# EAGLE design linkitsmart7688duo_doorcontroller (EAGLE 7.7.0)
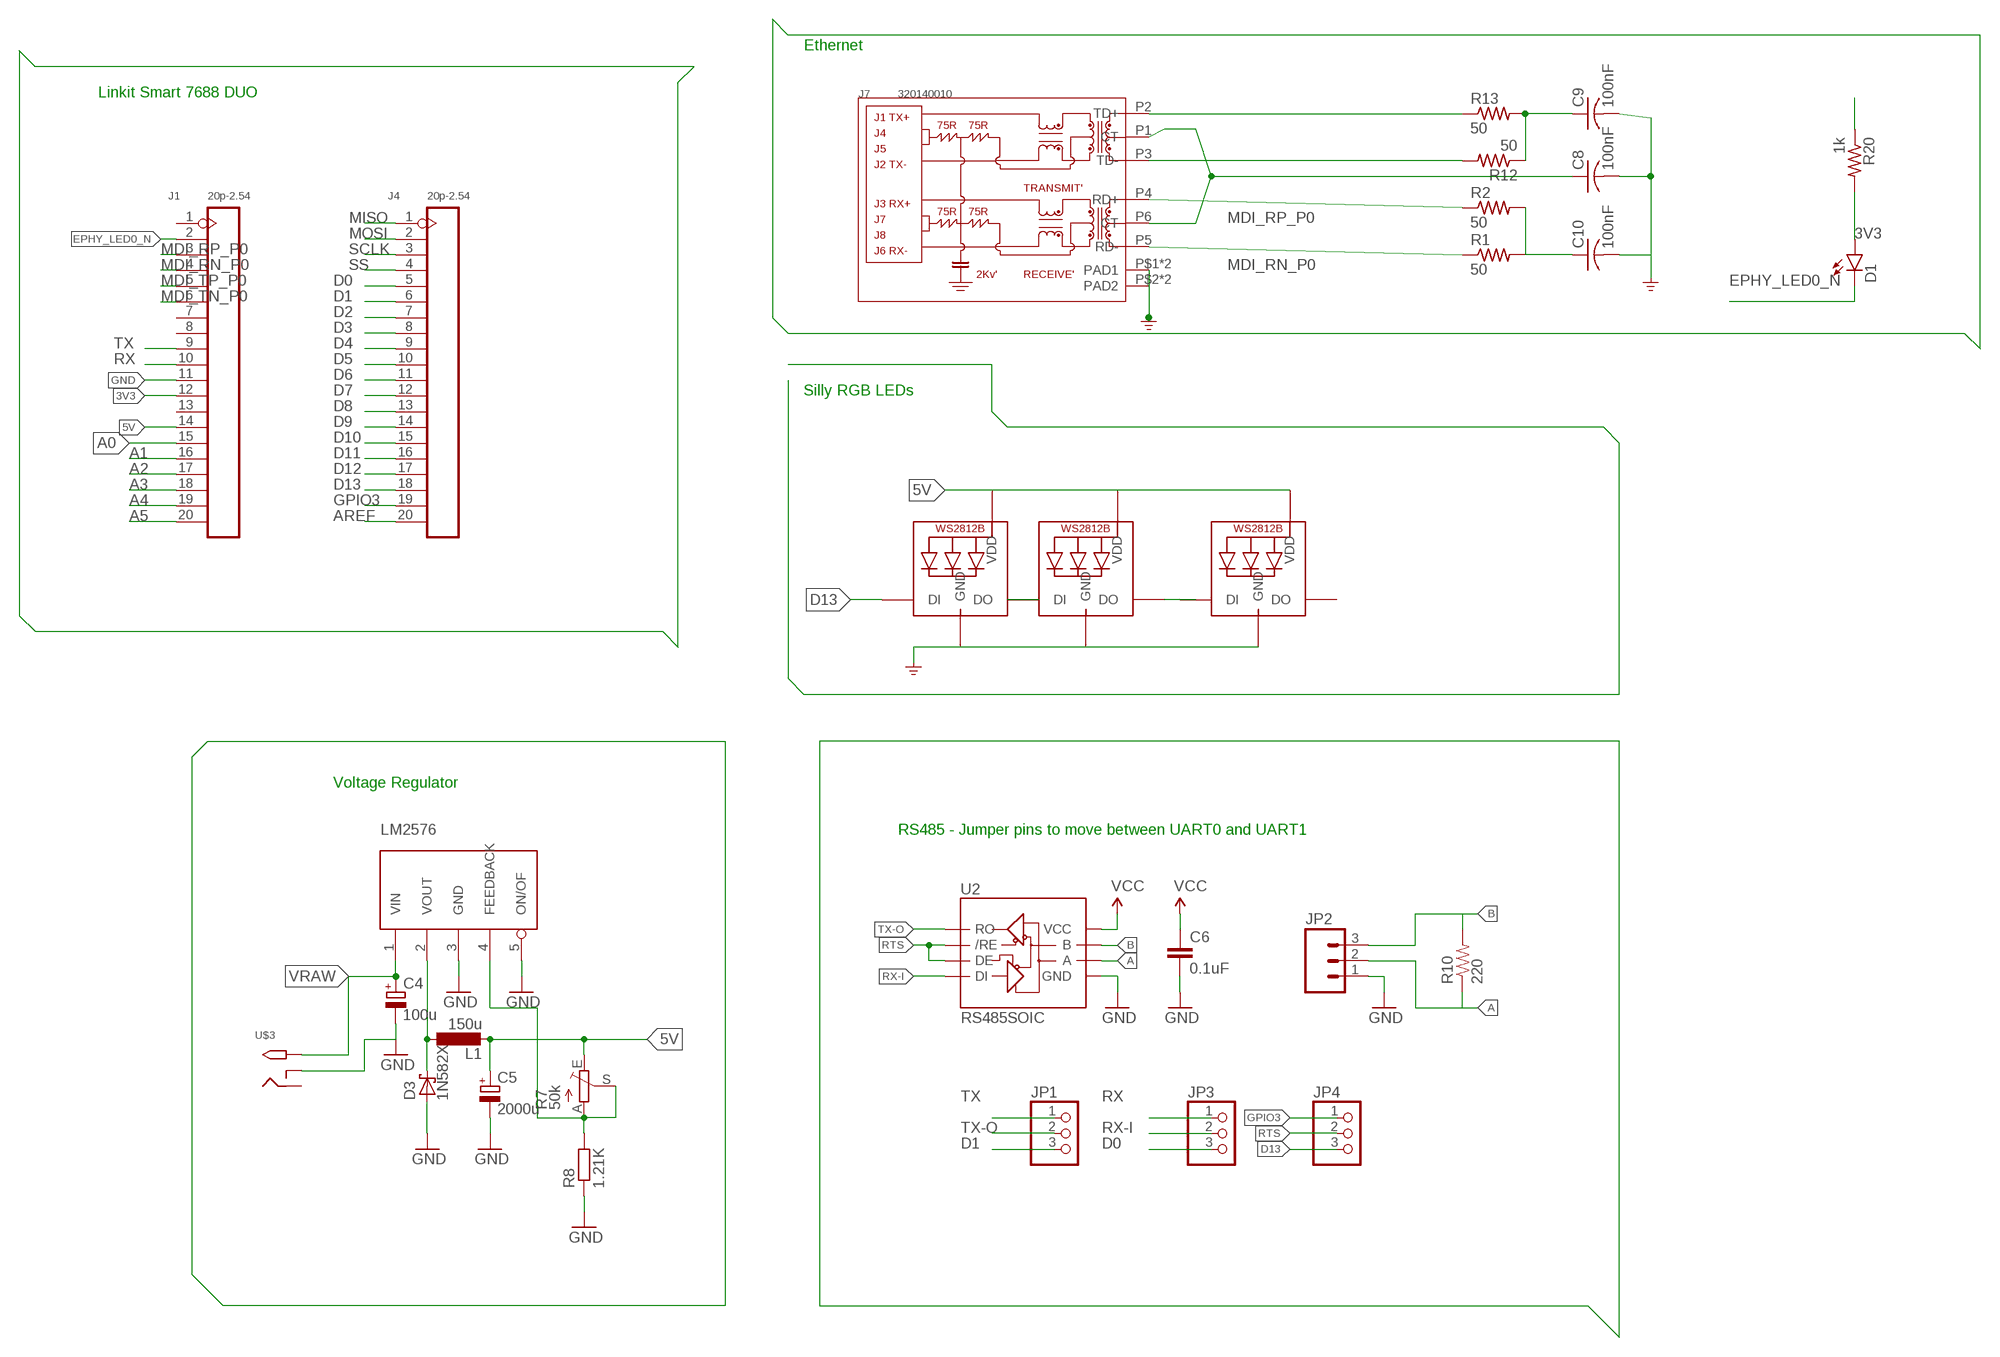
[diagram p0: schematic, sheet 1, part 1 of 2]
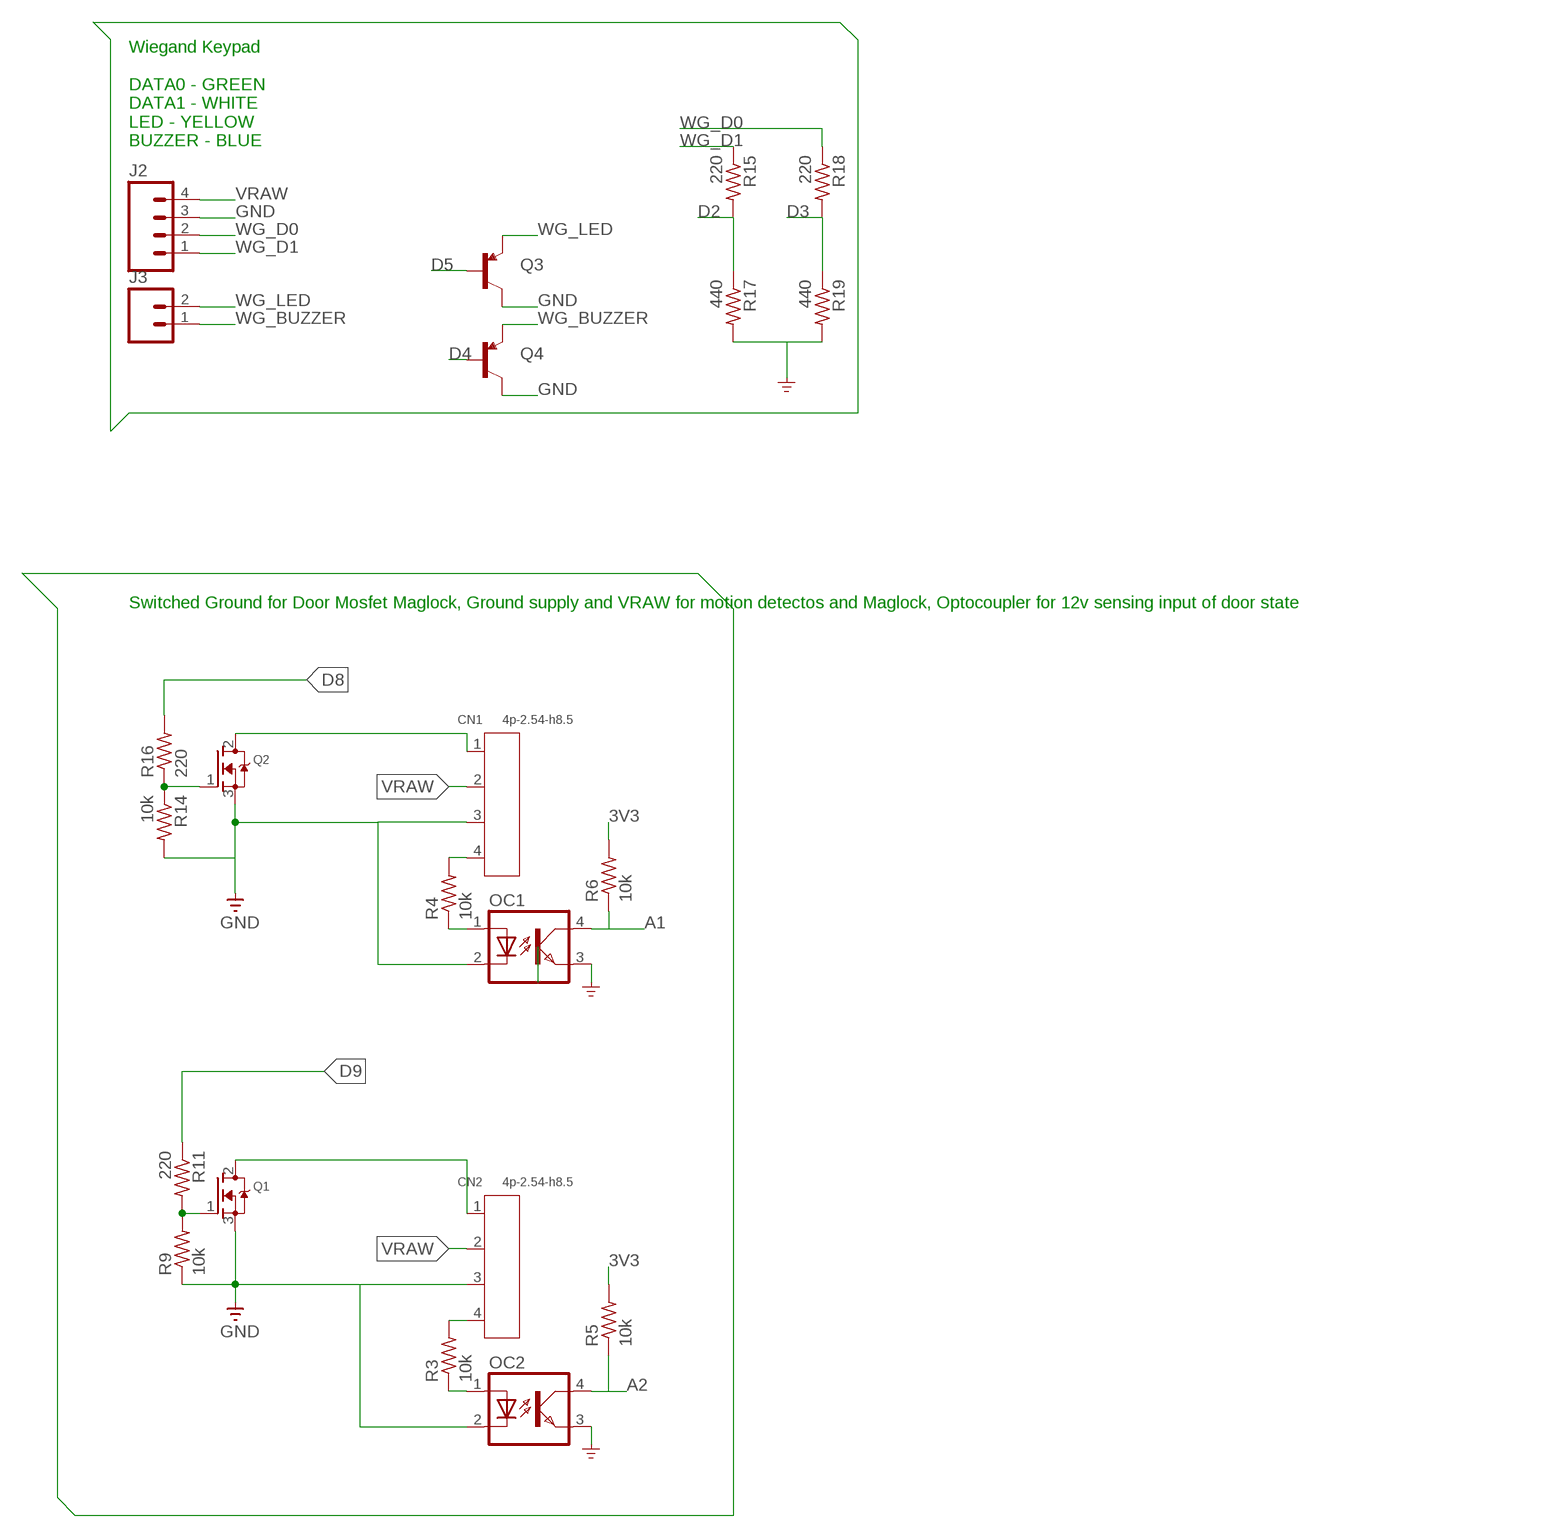
[diagram p1: schematic, sheet 1, part 2 of 2]

## Parts
C4  100u  CPOL-EUE3.5-10  [E3,5-10]
C5  2000u  CPOL-EUE7.5-18  [E7,5-18]
C6  0.1uF  0.1UF-25V(+80/-20%)(0603)  [0603-CAP]
C8  100nF  C-US025-024X044  [C025-024X044]
C9  100nF  C-US025-024X044  [C025-024X044]
C10  100nF  C-US025-024X044  [C025-024X044]
CN1  4p-2.54-h8.5  DIP-SCREW-TERMINAL-GREEN(4P-2.54-H8.5)  [H4-2.54-8.52X6.3MM]
CN2  4p-2.54-h8.5  DIP-SCREW-TERMINAL-GREEN(4P-2.54-H8.5)  [H4-2.54-8.52X6.3MM]
D1  LED3MM  [LED3MM]
D3  1N582X  [DO201T15]
J1  20p-2.54  DIP-BLACK-FEMALE-HEADER-VERT(20P-2.54)  [H20-2.54]
J2  M04SCREW  [SCREWTERMINAL-3.5MM-4]
J3  M023.5MM  [SCREWTERMINAL-3.5MM-2]
J4  20p-2.54  DIP-BLACK-FEMALE-HEADER-VERT(20P-2.54)  [H20-2.54]
J7  320140010  RJ45-MJ6-BX11-RVS1T073  [RJ45-MJ6-BX11-RVS1T073]
JP1  PINHD-1X3  [1X03]
JP2  M03SCREW  [SCREWTERMINAL-3.5MM-3]
JP3  PINHD-1X3  [1X03]
JP4  PINHD-1X3  [1X03]
L1  150u  MY-INDUCTANCE  [MY-INDUCTANCE]
LED4  WS2812B_5050N  [WS2812B-NARROW]
LED5  WS2812B_5050N  [WS2812B-NARROW]
LED6  WS2812B_5050N  [WS2812B-NARROW]
OC1  PC817  [DIL04]
OC2  PC817  [DIL04]
Q1  MOSFET-NGDS_TO220V  [TO220V]
Q2  MOSFET-NGDS_TO220V  [TO220V]
Q3  TRANSISTOR_PNPBC558  [TO-92-AMMO]
Q4  TRANSISTOR_PNPBC558  [TO-92-AMMO]
R1  50  FLIPFLOP-RES  [0805-THM]
R2  50  FLIPFLOP-RES  [0805-THM]
R3  10k  FLIPFLOP-RES  [0805-THM]
R4  10k  FLIPFLOP-RES  [0805-THM]
R5  10k  FLIPFLOP-RES  [0805-THM]
R6  10k  FLIPFLOP-RES  [0805-THM]
R7  50k  TRIM_EU-RJ9W  [RJ9W]
R8  1.21K  R-EU_0204/7  [0204/7]
R9  10k  FLIPFLOP-RES  [0805-THM]
R10  220  22OHM1/10W1%(0603)  [0603-RES]
R11  220  FLIPFLOP-RES  [0805-THM]
R12  50  FLIPFLOP-RES  [0805-THM]
R13  50  FLIPFLOP-RES  [0805-THM]
R14  10k  FLIPFLOP-RES  [0805-THM]
R15  220  FLIPFLOP-RES  [0805-THM]
R16  220  FLIPFLOP-RES  [0805-THM]
R17  440  FLIPFLOP-RES  [0805-THM]
R18  220  FLIPFLOP-RES  [0805-THM]
R19  440  FLIPFLOP-RES  [0805-THM]
R20  1k  FLIPFLOP-RES  [0805-THM]
U2  RS485SOIC  [SO08]
U$1  LM2576  [TO220-5]
U$3  2.1MMJACKTHM  [PJ-102A]

## Nets
3V3: J1.12 R5.2 R6.2 R20.1
5V [power]: C5.+ C6.1 J1.14 L1.P$2 LED4.1-VDD(VDD) LED5.1-VDD(VDD) LED6.1-VDD(VDD) R7.E U2.8(VCC) ; supply symbol labelled VCC
A: JP2.2 R10.1 U2.6(A)
A0: J1.15
A1: J1.16 OC1.4(COL) R6.1
A2: J1.17 OC2.4(COL) R5.1
A3: J1.18
A4: J1.19
A5: J1.20
AREF: J4.20
B: JP2.3 R10.2 U2.7(B)
D0: J4.5 JP3.3
D1: J4.6 JP1.3
D2: J4.7 R15.2 R17.1
D3: J4.8 R18.2 R19.1
D4: J4.9 Q4.2(B)
D5: J4.10 Q3.2(B)
D6: J4.11
D7: J4.12
D8: J4.13 R16.2
D9: J4.14 R11.1
D10: J4.15
D11: J4.16
D12: J4.17
D13: J4.18 JP4.3 LED4.4-DIN(DI)
EPHY_LED0_N: D1.K(C) J1.2
GND [power]: C4.- C5.- C6.2 C8.2 C9.2 C10.2 CN1.3 CN2.3 D3.A J1.11 J2.3 J7.P$1(PAD1) J7.P$2(PAD2) J7.PAD1 J7.PAD2 JP2.1 LED4.3-GND(GND) LED5.3-GND(GND) LED6.3-GND(GND) OC1.2(C) OC1.3(EMIT) OC2.2(C) OC2.3(EMIT) Q1.3(S) Q2.3(S) Q3.1(C) Q4.1(C) R8.1 R9.1 R14.2 R17.2 R19.2 U2.5(GND) U$1.3(GND) U$1.5(ON/OF) U$3.RING_SW ; supply symbol labelled GND_POWER
GPIO3: J4.19 JP4.1
MDI_RN_P0: J1.4 J7.P5(RD-) R1.1
MDI_RP_P0: J1.3 J7.P4(RD+) R2.1
MDI_TN_P0: J1.6 J7.P3(TD-) R12.2
MDI_TP_P0: J1.5 J7.P2(TD+) R13.1
MISO: J4.1
MOSI: J4.2
N$1: R7.A R7.S R8.2 U$1.4(FEEDBACK)
N$3: D3.C L1.P$1 U$1.2(VOUT)
N$4: Q1.1(G) R9.2 R11.2
N$5: CN2.1 Q1.2(D)
N$6: C8.1 J7.P1(CT) J7.P6(CT)
N$7: CN1.1 Q2.2(D)
N$8: Q2.1(G) R14.1 R16.1
N$9: C9.1 R12.1 R13.2
N$11: CN1.4 R4.2
N$12: C10.1 R1.2 R2.2
N$13: OC2.1(A) R3.1
N$14: D1.A R20.2
N$15: LED4.2-DOUT(DO) LED5.4-DIN(DI)
N$16: LED5.2-DOUT(DO) LED6.4-DIN(DI)
N$17: CN2.4 R3.2
N$18: OC1.1(A) R4.1
RTS: JP4.2 U2.2(/RE) U2.3(DE)
RX: J1.10 JP3.1
RX-I: JP3.2 U2.4(DI)
SCLK: J4.3
SS: J4.4
TX: J1.9 JP1.1
TX-O: JP1.2 U2.1(RO)
VRAW [power]: C4.+ CN1.2 CN2.2 J2.4 U$1.1(VIN) U$3.TIP
WG_BUZZER: J3.1 Q4.3(E)
WG_D0: J2.2 R18.1
WG_D1: J2.1 R15.1
WG_LED: J3.2 Q3.3(E)
Unconnected: J1.1 J1.7 J1.8 J1.13 LED6.2-DOUT(DO) U$3.RING

## Notes on the sheet
- Ethernet
- Linkit Smart 7688 DUO
- Wiegand Keypad
  
  DATA0 - GREEN
  DATA1 - WHITE
  LED - YELLOW
  BUZZER - BLUE
- Silly RGB LEDs
- Switched Ground for Door Mosfet Maglock, Ground supply and VRAW for motion detectos and Maglock, Optocoupler for 12v sensing input of door state
- Voltage Regulator
- RS485 - Jumper pins to move between UART0 and UART1

## Library data of the parts
C4 = rcl:CPOL-EU: POLARIZED CAPACITOR, European symbol; MPN: UPW1E101MED; OC_NEWARK: 55K0210
C5 = rcl:CPOL-EU: POLARIZED CAPACITOR, European symbol; MPN: ERJ-14NF2000U; OC_NEWARK: 53W4097
C6 = SparkFun-Capacitors:0.1UF-25V(+80/-20%)(0603): CAP-00810 Ceramic Standard decoupling cap; MF: CORNELL DUBILIER; MPN: 104M06QC100; OC_NEWARK: 72K6759; PROD_ID: CAP-00810
C8-C10 = adafruit:C-US: CAPACITOR, American symbol
CN1 CN2 = Seeed-OPL-Connector:DIP-SCREW-TERMINAL-GREEN(4P-2.54-H8.5): 320110118; MPN: GS019-2.54-4P-1
D1 = SparkFun-LED:LED: LEDs Standard schematic elements and footprints for 5mm, 3mm, 1206, and 0603 sized LEDs. 5mm - Spark Fun Electronics SKU : COM-00529 (and others); PROD_ID: DIO-08794
D3 = mylib:1N582X; OC_NEWARK: unknown
J1 J4 = Seeed-OPL-Connector:DIP-BLACK-FEMALE-HEADER-VERT(20P-2.54): 320030027; MPN: F185-1120A0BSYA1
J2 = SparkFun-Connectors:M04: Header 4 Standard 4-pin 0.1" header. Use with straight break away headers (SKU : PRT-00116), right angle break away headers (PRT-00553), swiss pins (PRT-00743), machine pins (PRT-00117), and female headers (PRT-00115). Molex polarized connector foot print use with SKU : PRT-08231 with associated crimp pins and housings. 1MM SMD Version SKU: PRT-10208; PROD_ID: Combine 2x8399
J3 = SparkFun-Connectors:M02: Standard 2-pin 0.1" header. Use with - straight break away headers ( PRT-00116) - right angle break away headers (PRT-00553) - swiss pins (PRT-00743) - machine pins (PRT-00117) - female headers (PRT-00115) Molex polarized connector foot print use with: PRT-08233 with associated crimp pins and housings. 2.54_SCREWTERM for use with PRT-10571. 3.5mm Screw Terminal footprints for PRT-08084 5mm Screw Terminal footprints for use with PRT-08432; PROD_ID: CONN-08399
J7 = Connector-new:RJ45-MJ6-BX11-RVS1T073: 320140010; OC_NEWARK: unknown
JP1 JP3 JP4 = adafruit:PINHD-1X3: PIN HEADER
JP2 = SparkFun:M03: Header 3 Standard 3-pin 0.1" header. Use with straight break away headers (SKU : PRT-00116), right angle break away headers (PRT-00553), swiss pins (PRT-00743), machine pins (PRT-00117), and female headers (PRT-00115). Molex polarized connector foot print use with SKU : PRT-08232 with associated crimp pins and housings.; OC_NEWARK: unknown
L1 = mylib:MY-INDUCTANCE; MPN: ACS770KCB-150U-PFF-T; OC_NEWARK: 12X7864
LED4-LED6 = adafruit:WS2812B
OC1 OC2 = optocoupler:PC817: SHARP OPTO COUPLER
Q1 Q2 = adafruit:MOSFET-N: N-Channel Mosfet 2N7002E - 60V 260mA SOT23 [Digikey: 2N7002ET1GOSTR-ND] - REEL BSH103 - 30V 850mA SOT23 [Digikey: 568-5013-1-ND]; MPN: SM6T68A; OC_NEWARK: 34M8616
Q3 Q4 = User-Submitted:TRANSISTOR_PNP: Generic PNP BJT Double check pinouts against datasheets- not all devices are the same! MMBT3906 - 40V 200mA SOT-23 (TRANS-08052) MMBT4403 - 40V 600mA SOT-23 (TRANS-09245)
R1-R6 R9 R11-R20 = adafruit:FLIPFLOP-RES: Flip Flop resistor An 0805 resistor inside a standard 1/4W 5% resistor. Makes for easy mods
R7 = pot:TRIM_EU-: POTENTIOMETER; MPN: MC00625W04021150K; OC_NEWARK: 94W5316
R8 = resistor:R-EU_: RESISTOR, European symbol; MPN: ERJ-8ENF1211V; OC_NEWARK: 65T8849
R10 = SparkFun-Resistors:22OHM1/10W1%(0603): RES-08698; MF: KEMET; MPN: C0603C221K5RACTU; OC_NEWARK: 64K2849; PROD_ID: RES-08698; VALUE: 22
U2 = SparkFun:RS485; MF: ALTERA CORPORATION; MPN: ADM4850ARZ; OC_NEWARK: 59K2126
U$1 = mylib:LM2576; MF: NATIONAL SEMICONDUCTOR; MPN: LM2576T-12/NOPB; OC_NEWARK: 41K3697
U$3 = adafruit:2.1MMJACK: 2.1mm x 5.5mm THM DC jack with internal switch. Digikey part #PJ-102A, 4UCON part #05537 2.1mm x 5.5mm SMT DC jack with internal switch. Digikey part #PJ-002A-SMT, 4UCON part #03267 By microbuilder.eu & adafruit.com

## Net classes
0 default: width 0.254 mm
1 power: width 0.762 mm

## Board
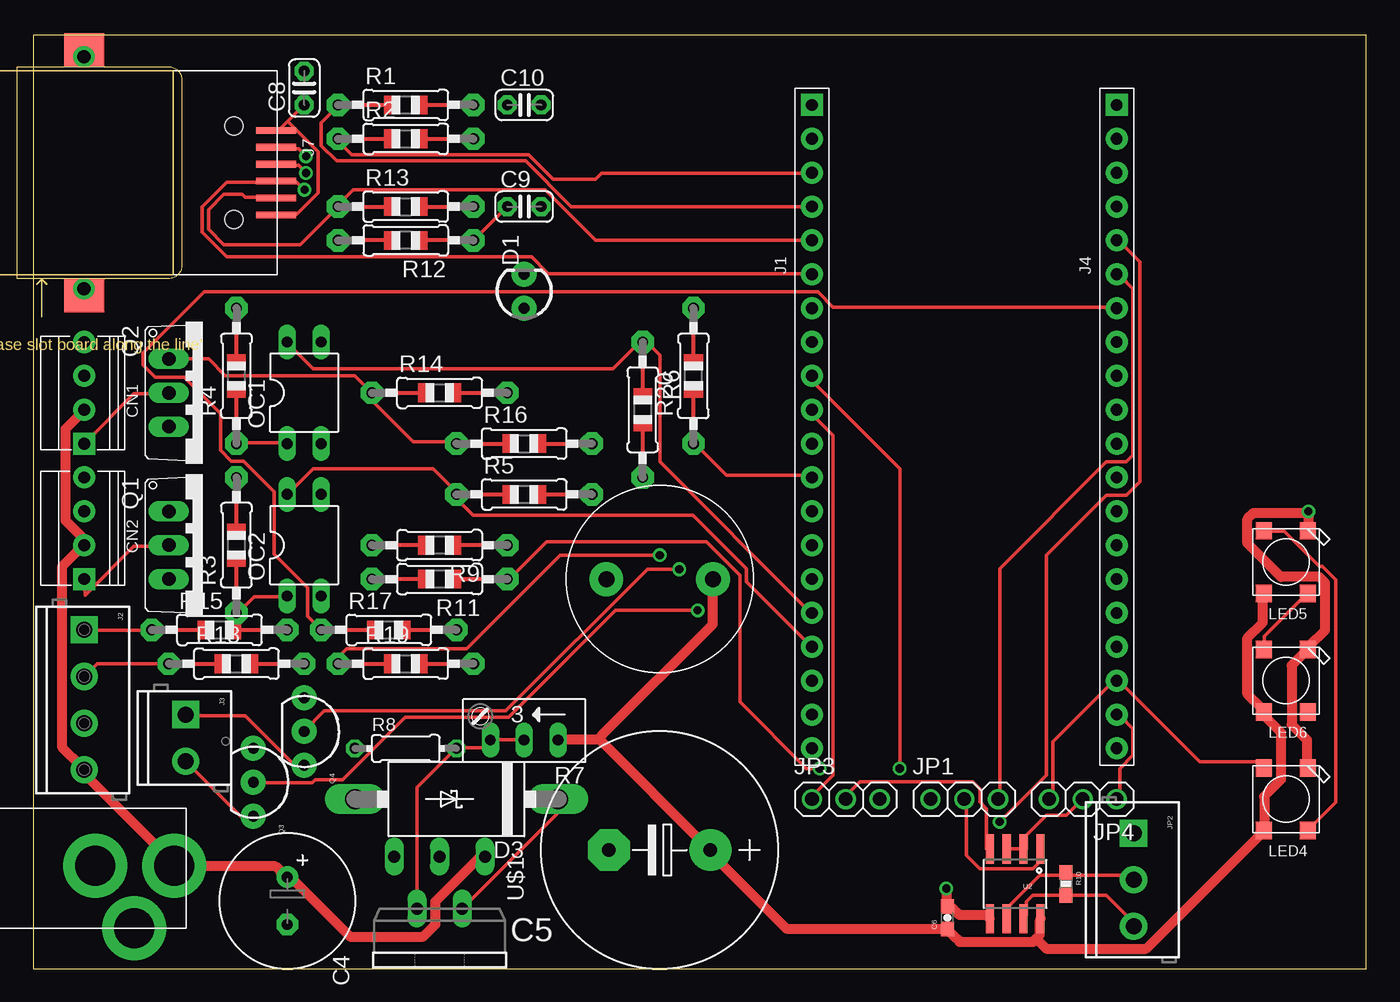
[diagram p2: board, top side]
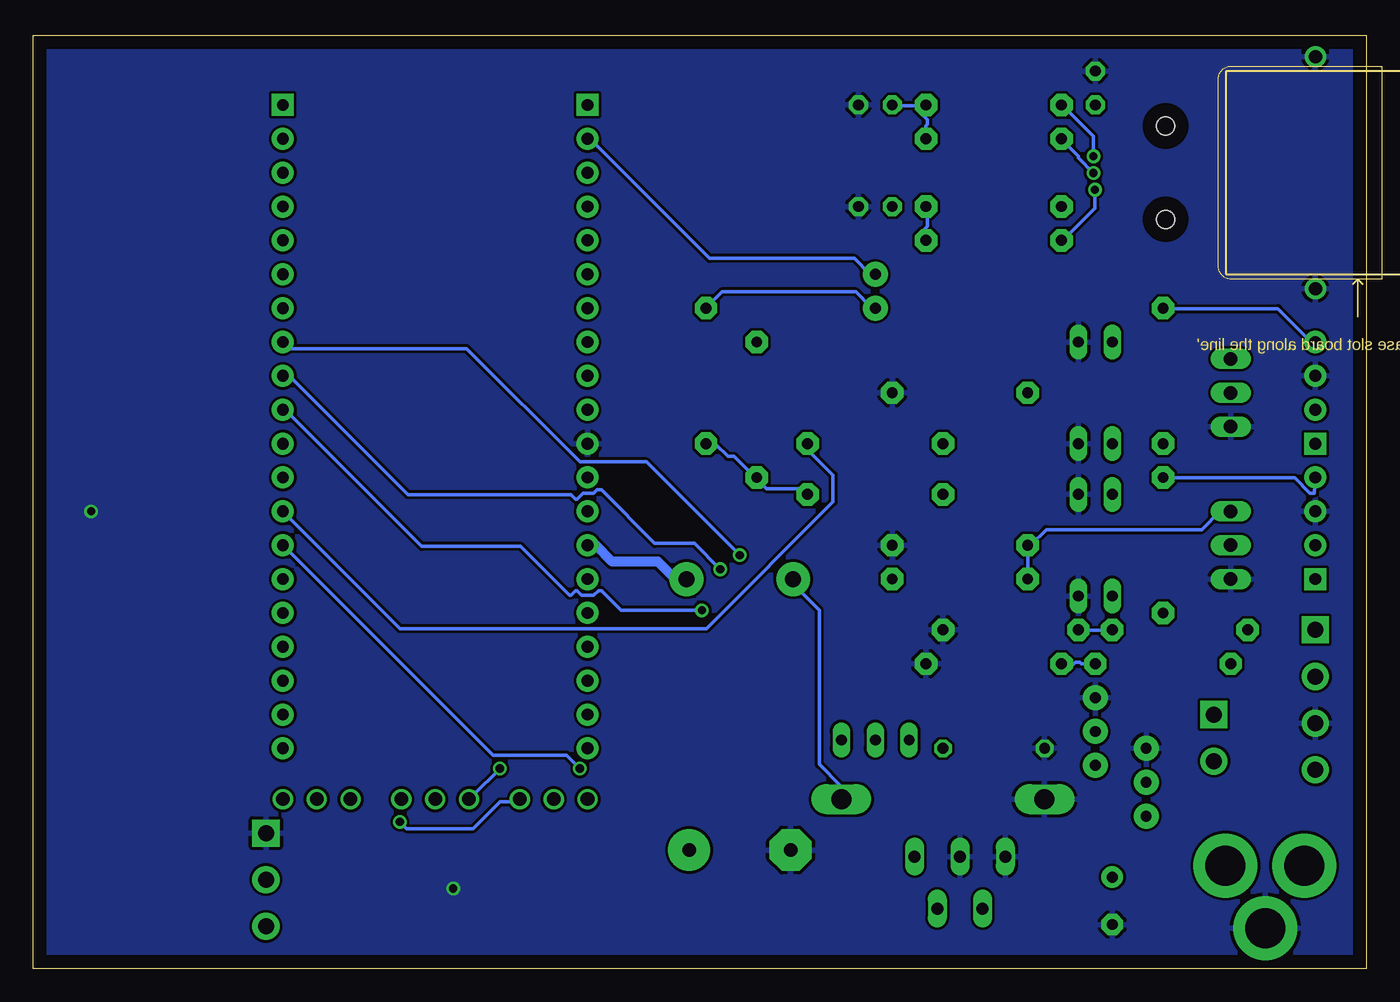
[diagram p3: board, bottom side, seen from below]

Size 100 x 70 mm. Coordinates in mm from the lower left corner, seen from the top.
Outline: 0,0 100,0 100,70 0,70 0,0
Copper layers (1*16): Top 0.035mm / dielectric 1.5mm / Bottom 0.035mm
Design rules "default": minimum track width 10mil, minimum drill 24mil, track to track 8mil, track to pad 8mil, pad to pad 8mil, via to via 8mil, smd to smd 8mil, copper to edge 40mil, drill to drill 8mil, minimum pad ring 10mil, minimum via ring 8mil, stop-mask expansion 4mil, vias tented up to drill 0mil, thermal gap 10mil

### Footprints (pad centres in the part's own frame; a part is rotated, then mirrored left to right if it is on the bottom)
E3,5-10 = drill 0.813 pad 1.6: + -1.778,0 | drill 0.813 pad 1.6 octagon: - 1.778,0
E7,5-18 = drill 1.016 pad 3.15: + -3.81,0 | drill 1.016 pad 3.15 octagon: - 3.81,0
0603-CAP = smd 1.1 x 1: 1 -0.85,0; 2 0.85,0
C025-024X044 = drill 0.813 pad 1.422 octagon: 1 -1.27,0; 2 1.27,0
H4-2.54-8.52X6.3MM = drill 0.889 pad 1.651 square: 1 0,3.81 | drill 0.889 pad 1.651: 2 0,1.27; 3 0,-1.27; 4 0,-3.81
LED3MM = drill 0.813 pad 1.88: A -1.27,0; K 1.27,0
DO201T15 = drill 1.499 long: A 7.62,0; C -7.62,0
H20-2.54 = drill 0.889 pad 1.651 square: 1 0,24.13 | drill 0.889 pad 1.651: 2 0,21.59; 3 0,19.05; 4 0,16.51; 5 0,13.97; 6 0,11.43; 7 0,8.89; 8 0,6.35; 9 0,3.81; 10 0,1.27; 11 0,-1.27; 12 0,-3.81; 13 0,-6.35; 14 0,-8.89; 15 0,-11.43; 16 0,-13.97; 17 0,-16.51; 18 0,-19.05; 19 0,-21.59; 20 0,-24.13
SCREWTERMINAL-3.5MM-4 = drill 1.2 pad 2.032 square: 1 0,0 | drill 1.2 pad 2.032: 2 3.5,0; 3 7,0; 4 10.5,0
SCREWTERMINAL-3.5MM-2 = drill 1.2 pad 2.032 square: 1 0,0 | drill 1.2 pad 2.032: 2 3.5,0
RJ45-MJ6-BX11-RVS1T073 = smd 0.5 x 3: P1 3.175,14.4; P2 1.905,14.4; P3 0.635,14.4; P4 -0.635,14.4; P5 -1.905,14.4; P6 -3.175,14.4 | smd 2.5 x 3: P$1 -9.2,0; P$2 9.2,0 | drill 1 pad 1.6: PAD1 -8.7,0; PAD2 8.7,0 | hole 1.35: -3.5,11.24; 3.5,11.24
1X03 = drill 1.016: 1 -2.54,0; 2 0,0; 3 2.54,0
SCREWTERMINAL-3.5MM-3 = drill 1.2 pad 2.032 square: 1 0,0 | drill 1.2 pad 2.032: 2 3.5,0; 3 7,0
MY-INDUCTANCE = drill 1.2 pad 2.54: P$1 -4,0; P$2 4,0
WS2812B-NARROW = smd 1.3 x 1.2: 1-VDD 2.35,-1.65; 2-DOUT 2.35,1.65; 3-GND -2.35,1.65; 4-DIN -2.35,-1.65
DIL04 = drill 0.813 long: 1 -1.27,-3.81; 2 1.27,-3.81; 3 1.27,3.81; 4 -1.27,3.81
TO220V = drill 1.016 long: 1 -2.54,-2.54; 2 0,-2.54; 3 2.54,-2.54
TO-92-AMMO = drill 0.813 pad 1.88: 1 -2.54,0; 2 0,0; 3 2.54,0
0805-THM = drill 0.813 pad 1.676 octagon: 1 -5.08,0; 2 5.08,0
RJ9W = drill 0.813 long: A 2.54,0.635; E -2.54,0.635; S 0,0.635
0204/7 = drill 0.813 octagon: 1 -3.81,0; 2 3.81,0
0603-RES = smd 1.1 x 1: 1 -0.85,0; 2 0.85,0
SO08 = smd 0.61 x 2.21: 1 -1.905,-2.616; 2 -0.635,-2.616; 3 0.635,-2.616; 4 1.905,-2.616; 5 1.905,2.616; 6 0.635,2.616; 7 -0.635,2.616; 8 -1.905,2.616
TO220-5 = drill 0.9 long: 1 -3.4,-8.4; 2 -1.7,-4.5; 3 0,-8.4; 4 1.7,-4.5; 5 3.4,-8.4
PJ-102A = drill 3 pad 4.8: RING 0.1,-3.39; RING_SW -4.6,-6.29; TIP 0.1,-9.29

### Placement (x,y rotation side)
C4  19.05,5.08 270 top
C5  46.99,8.89 180 top
C6  68.58,3.81 90 top
C8  20.32,66.04 90 top
C9  36.83,57.15 0 top
C10  36.83,64.77 0 top
CN1  3.81,43.18 180 top
CN2  3.81,33.02 180 top
D1  36.83,50.8 90 top
D3  31.75,12.7 180 top
J1  58.42,40.64 0 top
J2  3.81,25.4 270 top
J3  11.43,19.05 270 top
J4  81.28,40.64 0 top
J7  3.81,59.69 270 top
JP1  69.85,12.7 0 top
JP2  82.55,10.16 270 top
JP3  60.96,12.7 0 top
JP4  78.74,12.7 180 top
L1  46.99,29.21 0 top
LED4  93.98,12.7 270 top
LED5  93.98,30.48 270 top
LED6  93.98,21.59 270 top
OC1  20.32,43.18 0 top
OC2  20.32,31.75 0 top
Q1  12.7,31.75 270 top
Q2  12.7,43.18 270 top
Q3  16.51,13.97 270 top
Q4  20.32,17.78 270 top
R1  27.94,64.77 0 top
R2  27.94,62.23 0 top
R3  15.24,31.75 90 top
R4  15.24,44.45 90 top
R5  36.83,35.56 0 top
R6  45.72,41.91 270 top
R7  36.83,17.78 180 top
R8  27.94,16.51 0 top
R9  30.48,31.75 180 top
R10  77.47,6.35 270 top
R11  30.48,29.21 180 top
R12  27.94,54.61 180 top
R13  27.94,57.15 0 top
R14  30.48,43.18 0 top
R15  13.97,25.4 0 top
R16  36.83,39.37 0 top
R17  26.67,25.4 0 top
R18  15.24,22.86 0 top
R19  27.94,22.86 0 top
R20  49.53,44.45 90 top
U2  73.66,6.35 180 top
U$1  30.48,0 180 top
U$3  1.27,7.62 90 top

### Tracks (layer width: path | path; a pad name or v marks a point on that pad's centre or on a via)
3V3
  Top 0.254: J1.12 58,37 52,37 50,39 R20.1
  Bottom 0.254: R20.1 49.49,39.32 48.81,39.32 47.89,38.41 47.43,38.41 45.83,36.8 R6.2 45.5,36.5 45,36 42,36 R5.2
5V
  Top 0.762: 42.52,17.14 R7.E | 42.52,17.14 50.52,9.14 C5.+ 51,8.5 56.5,3 68.5,3 C6.1 69,2.5 69.5,2 75,2 75.25,2.25 | L1.P$2 50.98,29.15 50.98,25.83 42.63,17.49 42.52,17.14 | LED5.1-VDD 92.24,28.12 92.24,25.95 91.1,24.8 91.1,20.57 92.13,19.55 LED6.1-VDD 92.35,19.2 92.35,18.97 93.61,17.72 93.61,14.17 92.35,12.92 92.35,10.4 LED4.1-VDD 92,10 83.5,1.5 76,1.5 75.25,2.25 | 75.25,2.25 75.5,2.5 75.5,3.5 U2.8
  Bottom 0.762: J1.14 58.41,31.77 57.84,31.77 56.58,30.52 53.15,30.52 51.89,29.26 51.09,29.26 L1.P$2
A
  Top 0.254: JP2.2 82.5,7 77.5,7 R10.1 77,7 75.5,7 73,4.5 73,4 U2.6
A1
  Top 0.254: OC1.4 19.5,46.5 21,45 43.5,45 45.5,47 R6.1 46,47 47,46 47,38 58,27 J1.16
A2
  Top 0.254: OC2.4 19.5,36 21,37.5 30,37.5 31.5,36 R5.1 31.5,35.5 33,34 49.5,34 53.5,30 53.5,29 58,24.5 J1.17
B
  Top 0.254: JP2.3 82.5,3.5 80.5,5.5 R10.2 75,5.5 74.5,5 74.5,4 U2.7
D0  (via drill 0.61)
  Top 0.254: v72.5,11 76,14.5 76,31 80.5,35.5 82,35.5 83,36.5 83,53 81.5,54.5 J4.5
  Bottom 0.254: v72.5,11 72,10.5 67,10.5 65,12.5 63.5,12.5 JP3.3
D1
  Top 0.254: JP1.3 72.5,13 72.5,30 80.5,38 82,38 82.5,38.5 82.5,51 81.5,52 J4.6
D2
  Top 0.254: J4.7 81.27,49.61 60.01,49.61 58.86,50.75 12.8,50.75 8.23,46.18 8.23,45.26 9.14,44.35 11.32,44.35 14.06,41.6 14.06,38.86 14.86,38.06 15.77,38.06 18.06,35.78 18.06,31.09 20.57,28.57 20.57,26.4 21.49,25.49 R17.1
  Bottom 0.254: R15.2 19.09,25.38 21.49,25.38 R17.1
D3  (via drill 0.61)
  Top 0.254: v47,31 39.5,31 32.5,24 23.5,24 22.5,23 R19.1
  Bottom 0.254: R18.2 21.37,22.86 21.49,22.97 21.83,22.97 22.06,22.75 22.86,22.75 R19.1 | v47,31 54,38 59,38 67.5,46.5 81,46.5 J4.8
D4  (via drill 0.61)
  Top 0.254: v48.46,29.95 46.06,29.95 35.43,19.32 21.83,19.32 20.34,17.83 Q4.2
  Bottom 0.254: v48.46,29.95 50.41,31.89 53.38,31.89 57.38,35.89 57.72,35.89 57.95,35.66 58.75,35.66 59.21,35.2 59.32,35.2 59.66,35.55 71.89,35.55 80.7,44.35 81.27,44.35 J4.9
D5  (via drill 0.61)
  Top 0.254: v49.84,26.86 43.66,26.86 35.66,18.86 27.89,18.86 23.2,14.17 21.14,14.17 20.92,13.95 16.57,13.95 Q3.2
  Bottom 0.254: v49.84,26.86 55.89,26.86 57.38,28.35 57.61,28.35 57.95,28 58.86,28 59.21,28.35 59.32,28.35 59.66,28 59.78,28 63.44,31.66 70.87,31.66 81.04,41.83 81.27,41.83 J4.10
D8
  Bottom 0.254: J4.13 81,34 72.5,25.5 49.5,25.5 40,35 40,37 42,39 R16.2
D9  (via drill 0.61)
  Top 0.254: v59,15 58,15 53,20 53,29.5 50.5,32 38.5,32 36,29.5 R11.1
  Bottom 0.254: v59,15 60,16 65.5,16 81,31.5 J4.14
D13
  Top 0.254: LED4.4-DIN 92,15.5 87.5,15.5 81.5,21.5 J4.18 81,21.5 76.5,17 76.5,13 JP4.3
EPHY_LED0_N
  Bottom 0.254: J1.2 58.41,62.18 58.18,62.18 49.26,53.26 38.41,53.26 37.26,52.12 36.92,52.12 D1.K
GND  (via drill 0.61)
  Top 0.762: J7.P$2 3.89,50.52 3.89,50.98 J7.PAD2 | LED5.3-GND 95.67,32.92 v95.67,34.29 95.33,34.18 91.55,34.18 91.1,33.72 91.1,31.89 93.61,29.38 96.47,29.38 96.93,28.92 96.93,25.38 95.78,24.23 LED6.3-GND 95.56,23.89 94.41,22.75 94.41,18.29 95.56,17.14 95.56,15.09 LED4.3-GND | v68.5,6 68.5,5 C6.2 69,4.5 69.5,4 71.5,4 U2.5 | J7.P$1 4,68.5 J7.PAD1
  pour Bottom: 0,69.85 99.06,69.85 100.33,69.85 100.33,0 0,0
GPIO3
  Top 0.254: JP4.1 81.5,13 81.5,15 82.5,16 82.5,18 81.5,19 J4.19
MDI_RN_P0  (via drill 0.61)
  Top 0.254: v20.46,60.92 19.89,61.49 18.29,61.49 J7.P5 | J1.4 40.35,57.15 36.92,60.58 22.75,60.58 21.6,61.72 21.6,63.44 22.86,64.69 R1.1
  Bottom 0.254: v20.46,60.92 20.46,62.41 22.86,64.81 R1.1
MDI_RP_P0  (via drill 0.61)
  Top 0.254: v20.46,59.66 19.89,60.24 18.29,60.24 J7.P4 | R2.1 22.86,62.06 23.89,61.04 37.15,61.04 38.98,59.21 42.18,59.21 42.63,59.66 58.41,59.66 J1.3
  Bottom 0.254: v20.46,59.66 21.6,60.81 21.6,60.92 22.86,62.18 R2.1
MDI_TN_P0  (via drill 0.61)
  Top 0.254: v20.34,58.41 19.77,58.98 18.29,58.98 J7.P3 18.17,58.98 14.52,58.98 12.69,57.15 12.69,55.21 14.52,53.38 37.38,53.38 38.63,52.12 58.41,52.12 J1.6
  Bottom 0.254: v20.34,58.41 20.34,57.04 22.86,54.52 R12.2
MDI_TP_P0
  Top 0.254: J7.P2 18.17,57.84 15.89,57.84 15.66,58.06 14.29,58.06 13.14,56.92 13.14,55.44 14.29,54.29 20,54.29 R13.1 22.86,57.26 24,58.41 38.41,58.41 42.18,54.63 58.41,54.63 J1.5
N$1
  Top 0.254: R7.S R7.A 33.72,16.57 31.77,16.57 R8.2 31.66,16.46 28.8,13.6 28.8,4.57 U$1.4
N$3
  Top 0.254: U$1.2 32.23,4.57 39.32,11.66 39.32,12.69 D3.C
  Bottom 0.254: L1.P$1 42.98,29.15 42.98,28.8 41.03,26.86 41.03,15.32 39.43,13.72 39.43,12.8 D3.C
N$4
  Bottom 0.254: Q1.1 10.97,34.29 12.34,32.92 24,32.92 25.15,31.77 25.38,31.77 R9.2 25.38,31.66 25.38,29.26 R11.2
N$5
  Top 0.254: Q1.2 10.06,31.66 7.54,31.66 3.89,28 CN2.1
N$6
  Top 0.254: 19.09,63.55 18.4,62.87 J7.P6 | 19.09,63.55 20.23,64.69 C8.1 | 19.09,63.55 21.37,61.27 21.37,58.18 19.77,56.58 18.29,56.58 J7.P1
N$7
  Top 0.254: Q2.2 10.06,43.09 7.54,43.09 3.89,39.43 CN1.1
N$8
  Top 0.254: Q2.1 13.14,45.72 14.4,44.46 24.12,44.46 R14.1 25,43 28.5,39.5 31.5,39.5 R16.1
N$9
  Top 0.254: C9.1 35.55,57.15 33.03,54.63 R12.1
  Bottom 0.254: R13.2 32.92,57.15 32.92,55.66 33.26,55.32 33.26,54.86 33.03,54.63 R12.1
N$11
  Bottom 0.254: CN1.4 3.89,47.09 4.23,47.09 6.63,49.49 15.2,49.49 R4.2
N$12
  Bottom 0.254: C10.1 35.55,64.69 33.03,64.69 R1.2 33.26,64.58 33.26,64.01 32.92,63.66 32.92,63.32 33.03,63.21 33.03,62.29 R2.2
N$13
  Top 0.254: OC2.1 18.97,27.89 16.57,27.89 15.32,26.63 R3.1
N$14
  Bottom 0.254: R20.2 49.49,49.61 48.35,50.75 38.29,50.75 37.15,49.61 36.92,49.61 D1.A
N$15
  Top 0.254: LED5.4-DIN 92.35,32.8 93.84,32.8 96.47,30.18 96.7,30.18 97.73,29.15 97.73,12.46 95.67,10.4 LED4.2-DOUT
N$16
  Top 0.254: LED6.4-DIN 92.35,24 92.35,24.92 95.56,28.12 LED5.2-DOUT
N$17
  Bottom 0.254: CN2.4 3.89,35.66 4.23,35.66 5.37,36.8 15.2,36.8 R3.2
N$18
  Top 0.254: OC1.1 18.97,39.43 15.32,39.43 R4.1
RTS
  Top 0.254: U2.3 73,9 74,9 U2.2 74.5,9 74.5,10 76,11.5 77.5,11.5 78.5,12.5 JP4.2
RX
  Top 0.254: JP3.1 58.5,13 60,14.5 60,40 58.5,41.5 J1.10
RX-I
  Top 0.254: U2.4 71.5,9 71.5,12 71,12.5 71,13.5 70.5,14 62,14 61,13 JP3.2
TX  (via drill 0.61)
  Top 0.254: v65,15 65,37.5 58.5,44 J1.9
  Bottom 0.254: v65,15 67,13 JP1.1
TX-O
  Top 0.254: U2.1 75.5,8.5 75.5,8 75,7.5 71,7.5 70,8.5 70,12.5 JP1.2
VRAW
  Top 0.762: CN1.2 3.77,41.83 2.4,40.46 2.4,33.6 3.77,32.23 3.77,31.77 CN2.2 3.54,31.55 2.17,30.18 2.17,16.57 3.54,15.2 J2.4 3.89,14.86 3.89,14.52 10.4,8 U$3.TIP 10.63,7.66 18.17,7.66 18.75,7.09 C4.+ 19.43,6.74 23.77,2.4 29.26,2.4 30.18,3.31 30.18,5.03 33.49,8.34 33.83,8.34 U$1.1
WG_BUZZER
  Top 0.254: Q4.3 20.23,15.32 19.55,15.32 15.89,18.97 11.43,18.97 J3.1
WG_D0
  Top 0.254: R18.1 4.8,22.86 3.89,21.95 J2.2
WG_D1
  Top 0.254: R15.1 8.8,25.38 3.89,25.38 J2.1
WG_LED
  Top 0.254: Q3.3 15.54,11.43 J3.2